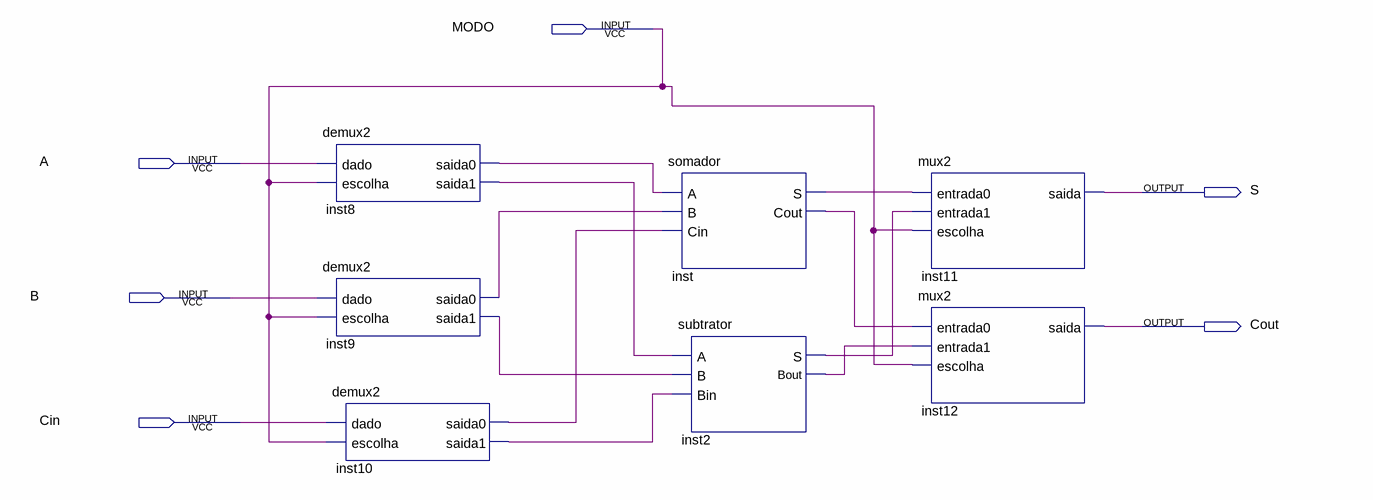
[diagram p0: schematic sheet]
// Quartus schematic somadorsubtrator.bdf as structural Verilog: 7 symbols, 6 pins
module somadorsubtrator (
  input  MODO,
  input  A,
  input  B,
  input  Cin,
  output S,
  output Cout
);

  wire inst2_bout, inst2_s, inst8_saida0, inst8_saida1, inst9_saida0, inst9_saida1, inst10_saida0,
       inst10_saida1, inst_cout, inst_s;

  demux2 inst8 (.dado(A), .escolha(MODO), .saida0(inst8_saida0), .saida1(inst8_saida1));
  demux2 inst9 (.dado(B), .escolha(MODO), .saida0(inst9_saida0), .saida1(inst9_saida1));
  demux2 inst10 (.dado(Cin), .escolha(MODO), .saida0(inst10_saida0), .saida1(inst10_saida1));
  somador inst (.A(inst8_saida0), .B(inst9_saida0), .Cin(inst10_saida0), .S(inst_s), .Cout(inst_cout));
  subtrator inst2 (.A(inst8_saida1), .B(inst9_saida1), .Bin(inst10_saida1), .S(inst2_s), .Bout(inst2_bout));
  mux2 inst11 (.entrada0(inst_s), .entrada1(inst2_s), .escolha(MODO), .saida(S));
  mux2 inst12 (.entrada0(inst_cout), .entrada1(inst2_bout), .escolha(MODO), .saida(Cout));
endmodule
